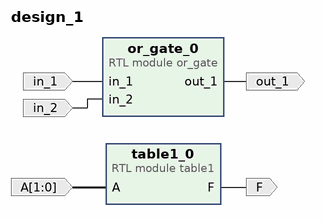
[diagram p0: block diagram of the top level]
# Vivado block design design_1, xc7z020clg400-1, Vivado 2022.2
create_bd_design design_1

create_bd_port -dir I -from 1 -to 0 A
create_bd_port -dir O F
create_bd_port -dir I in_1
create_bd_port -dir I in_2
create_bd_port -dir O out_1

create_bd_cell -type module -reference or_gate or_gate_0
create_bd_cell -type module -reference table1 table1_0

# ---- connections ----

connect_bd_net -net A_0_1 [get_bd_ports A] [get_bd_pins table1_0/A]
connect_bd_net -net in_1_0_1 [get_bd_ports in_1] [get_bd_pins or_gate_0/in_1]
connect_bd_net -net in_2_0_1 [get_bd_ports in_2] [get_bd_pins or_gate_0/in_2]
connect_bd_net [get_bd_pins or_gate_0/out_1] [get_bd_ports out_1]
connect_bd_net [get_bd_pins table1_0/F] [get_bd_ports F]

validate_bd_design
save_bd_design
